# Altium project Isolation2017.PrjPcb
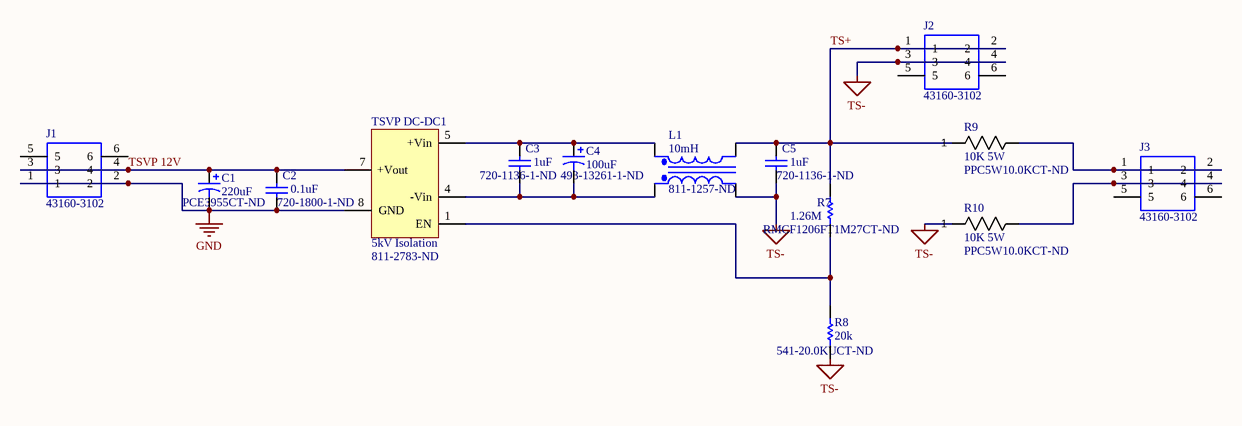
[diagram p0: Isolation.SchDoc]
1 sheet, 14 parts. Net scope: global (net labels, ports and power ports of the same name join across sheets).
Board file: Isolation.PcbDoc

## Sheet Isolation.SchDoc
size A4

### Parts
C1  220uF  Supplier Part Number 1: PCE3955CT-ND  [EEE-1VA221UP]
C2  value 0.1uF  Supplier Part Number 1: 720-1800-1-ND  [C1206]  (hidden comment: C0603)
C3  value 1uF  Supplier Part Number 1: 720-1136-1-ND  [2225 Package]  (hidden comment: C0603)
C4  100uF  Supplier Part Number 1: 493-13261-1-ND  [NichiconCAP]
C5  value 1uF  Supplier Part Number 1: 720-1136-1-ND  [2225 Package]  (hidden comment: C0603)
J1  43160-3102  [431603102]
J2  43160-3102  [431603102]
J3  43160-3102  [431603102]
L1  10mH  Supplier Part Number 1: 811-1257-ND  [52106C]
R7  value 1.26M  Supplier Part Number 1: RMCF1206FT1M27CT-ND  [C1206]  (hidden comment: Res1)
R8  20k  Supplier Part Number 1: 541-20.0KUCT-ND  [C1206]
R9  10K 5W  Supplier Part Number 1: PPC5W10.0KCT-ND  [Res THRU Hole 10k 5W]
R10  10K 5W  Supplier Part Number 1: PPC5W10.0KCT-ND  [Res THRU Hole 10k 5W]
TSVP_DC-DC1  Note: 5kV Isolation  Supplier Part Number 1: 811-2783-ND  [RUW15SL 12C]  (hidden comment: RUW15SL 12C)

### Nets
GND: C1.2 C2.1 J1.1 J1.2 TSVP_DC-DC1.8(GND)
TS-: C5.1 J2.3 J2.4 L1.4 R8.1 R10.1
TS+: C5.2 J2.1 J2.2 L1.3 R7.2 R9.1
TSVP 12V: C1.1 C2.2 J1.3 J1.4 TSVP_DC-DC1.7(+Vout)
NetC3_1: C3.1 C4.2 L1.1 TSVP_DC-DC1.4(-Vin)
NetC3_2: C3.2 C4.1 L1.2 TSVP_DC-DC1.5(+Vin)
NetJ3_1: J3.1 J3.2 R9.2
NetJ3_3: J3.3 J3.4 R10.2
NetR7_1: R7.1 R8.2 TSVP_DC-DC1.1(EN)

Not connected (* = marked no-connect by the designer): J1 5 6; J2 5 6; J3 5 6

### Library data of the parts
C1 = Cap Pol1: Panasonic Electrolytic 35V, 20% EEE-1VA221UP
C2 = C0603: C0603C104K3RACTU; Note: Footprint corresponds to dimensions for bulk cassette packaging. This case size has tightened tolerances.; Published: 17-Jul-2002; LatestRevisionDate: 19-Mar-2004; LatestRevisionNote: Silkscreen size reduced.; DatasheetDocument: Mar-2001; PackageDocument: Mar-2001; PackageReference: 0603; Publisher: Altium Limited; Code_JEITA: 0603; Code_IPC: 1608 [0603]; ComponentLink1Description: Manufacturer Link; ComponentLink1URL: http://www.kemet.com/; ComponentLink2Description: Datasheet; ComponentLink2URL: http://www.kemet.com/kemet/web/homepage/kechome.nsf/vapubfilesname/F3102TA.pdf/$file/F3102TA.pdf
C3 C5 = C0603_1: C0603C104K3RACTU; Note: Footprint corresponds to dimensions for bulk cassette packaging. This case size has tightened tolerances.; Published: 17-Jul-2002; LatestRevisionDate: 19-Mar-2004; LatestRevisionNote: Silkscreen size reduced.; DatasheetDocument: Mar-2001; PackageDocument: Mar-2001; PackageReference: 0603; Publisher: Altium Limited; Code_JEITA: 0603; Code_IPC: 1608 [0603]; ComponentLink1Description: Manufacturer Link; ComponentLink1URL: http://www.kemet.com/; ComponentLink2Description: Datasheet; ComponentLink2URL: http://www.kemet.com/kemet/web/homepage/kechome.nsf/vapubfilesname/F3102TA.pdf/$file/F3102TA.pdf
C4 = Cap Pol1_1: Nichicon 200V 100uF TH Capacitor  UCA2D101MHD6TN
J1-J3 = 43160-3102: 2 way PCB header r/a socket,14-18 awg Molex SABRE Series, Series Number 43160, 7.49mm Pitch 2 Way 1 Row Shrouded Right Angle PCB Header, Through Hole; Allied_Number: 70372885; Geometry.Height: 11mm; Manufacturer_Name: Molex; Manufacturer_Part_Number: 43160-3102; RS Part Number: 3639982P; RS Price/Stock: http://uk.rs-online.com/web/p/products/3639982P; Allied Price/Stock: https://www.alliedelec.com/molex-incorporated-43160-3102/70372885/; Arrow Part Number: 43160-3102; Arrow Price/Stock: http://uk.rs-online.com/web/p/products/3639982P; Datasheet Link: https://www.molex.com/pdm_docs/sd/431603102_sd.pdf; Supplier Part Number 1: WM18488-ND
L1 = Trans Ideal: MuRata 52106C Common Choke; Code_IEC: 1005; Published: 8-Jun-2000; LatestRevisionDate: 29-May-2009; LatestRevisionNote: IPC-7351 Footprint Added.; PackageReference: 0402-A; Publisher: Altium Limited; PackageDescription: Chip Inductor; Code_JEITA: 0402
R7 = Res1: Resistor; Published: 8-Jun-2000; LatestRevisionDate: 17-Jul-2002; LatestRevisionNote: Re-released for DXP Platform.; PackageReference: AXIAL-0.3; Publisher: Altium Limited; PackageDescription: Axial Device, Thru-Hole; 2 Leads; 0.3 in Pin Spacing
R8 = ERJ6EN: Precision Thick Film Chip Resistor, 10 Ohm to 2.2M Ohm Range, 1% Tolerance, 0805 Size, 0.1 W; Published: 17-Dec-2003; LatestRevisionDate: 19-Mar-2004; LatestRevisionNote: Silkscreen size reduced.; PackageDocument: Mar-2003; PackageReference: 6-0805; Publisher: Altium Limited; Code_IPC: 2012 [0805]; ComponentLink1Description: Manufacturer Link; ComponentLink1URL: http://www.panasonic.com/industrial/components/resistive_products.htm; ComponentLink2Description: Datasheet; ComponentLink2URL: http://www.panasonic.com/industrial/components/pdf/AOA0000CE2.pdf
R9 R10 = Resistor 10kOhm 5W